# Altium project Performance_Fitness_Vest.PrjPcb (part 1 of 2)
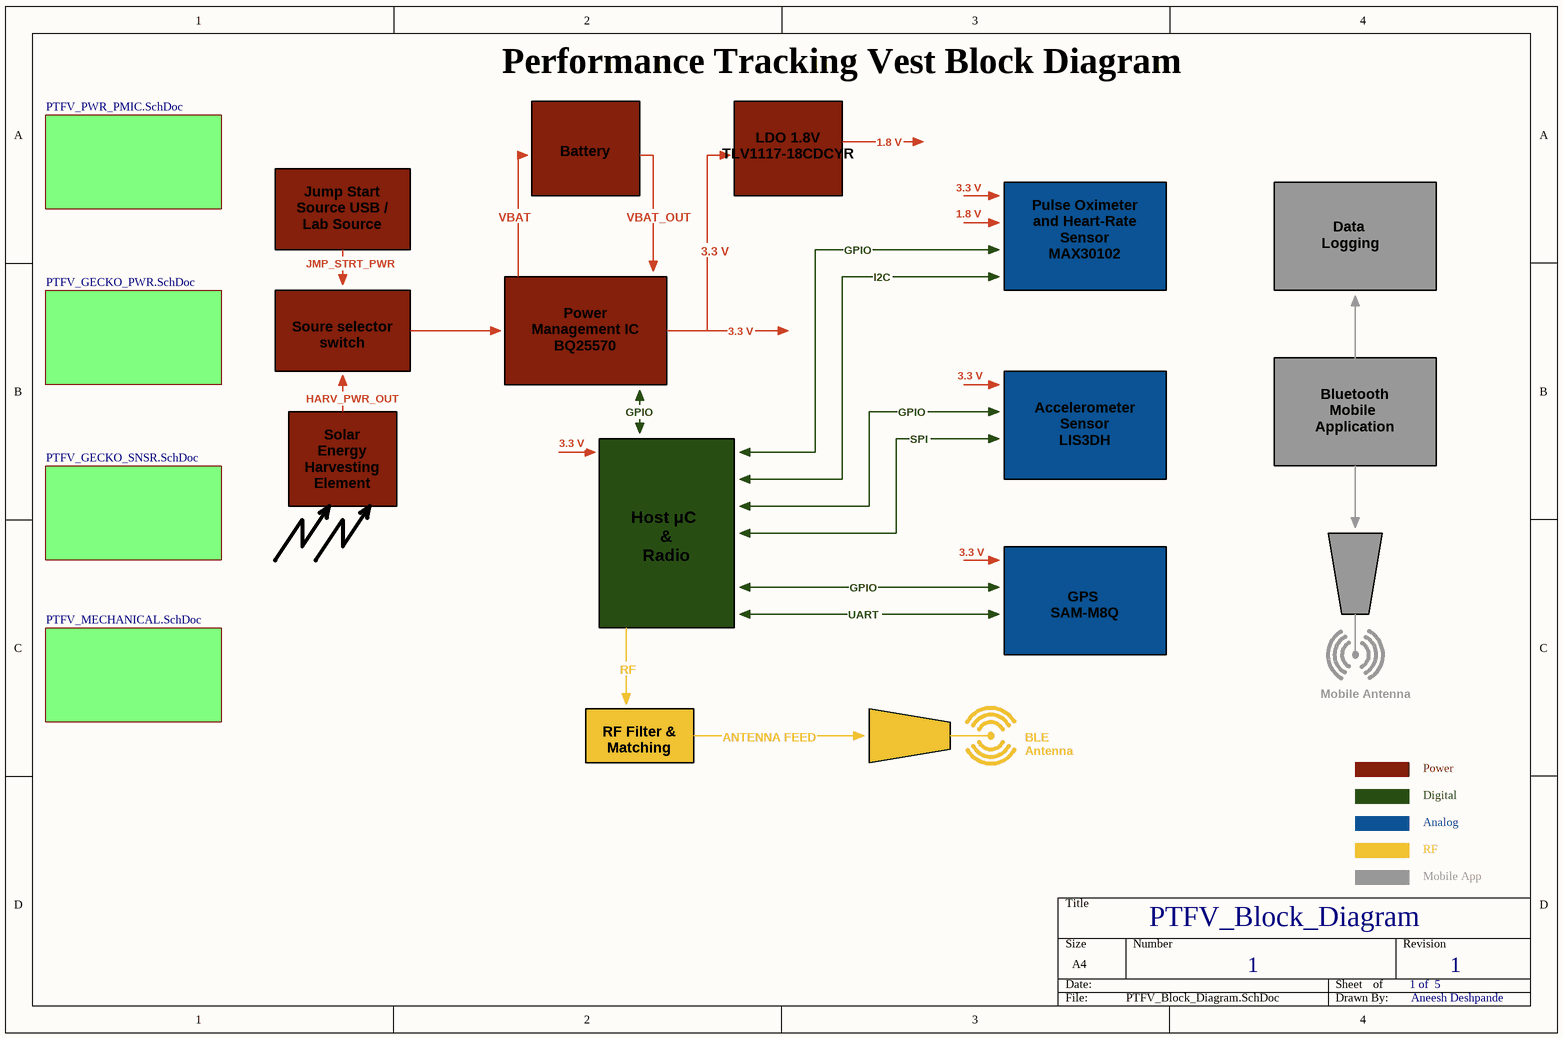
[diagram p0: PTFV_Block_Diagram.SchDoc]
5 sheets, 65 parts. Net scope: flat (ports and power ports of the same name join across sheets).
Sheets:
  PTFV_Block_Diagram.SchDoc
    Designator = PTFV_PWR_PMIC.SchDoc
    Designator = PTFV_GECKO_PWR.SchDoc
    Designator = PTFV_GECKO_SNSR.SchDoc
    Designator = PTFV_MECHANICAL.SchDoc

## Sheet PTFV_Block_Diagram.SchDoc: PTFV_Block_Diagram
size A4; DrawnBy: Aneesh Deshpande; DocumentNumber: 1; Revision: 1; SheetNumber: 1; SheetTotal: 1 of  5

### Sub-sheets
Designator = PTFV_PWR_PMIC.SchDoc: no entries
Designator = PTFV_GECKO_PWR.SchDoc: no entries
Designator = PTFV_GECKO_SNSR.SchDoc: no entries
Designator = PTFV_MECHANICAL.SchDoc: no entries

### Notes on the sheet
- Performance Tracking Vest Block Diagram
- Battery
- LDO 1.8V  TLV1117-18CDCYR
- 1.8 V
- Jump Start Source USB / Lab Source
- VBAT
- VBAT_OUT
- 3.3 V
- GPIO
- JMP_STRT_PWR
- I2C
- Pulse Oximeter and Heart-Rate Sensor
  MAX30102
- Data
  Logging
- Soure selector switch
- Power Management IC BQ25570
- HARV_PWR_OUT
- SPI
- Accelerometer
  Sensor
  LIS3DH
- Bluetooth
  Mobile
  Application
- Solar Energy Harvesting Element
- Host μC
  &
  Radio
- UART
- GPS
  SAM-M8Q
- RF
- Mobile Antenna
- RF Filter &
  Matching
- ANTENNA FEED
- BLE
  Antenna
- Power
- Digital
- Analog
- Mobile App

## Sheet PTFV_PWR_PMIC.SchDoc: PTFV_PWR_PMIC
size A4; DrawnBy: Aneesh Deshpande; Revision: 1; SheetNumber: 2; SheetTotal: 2  of  5
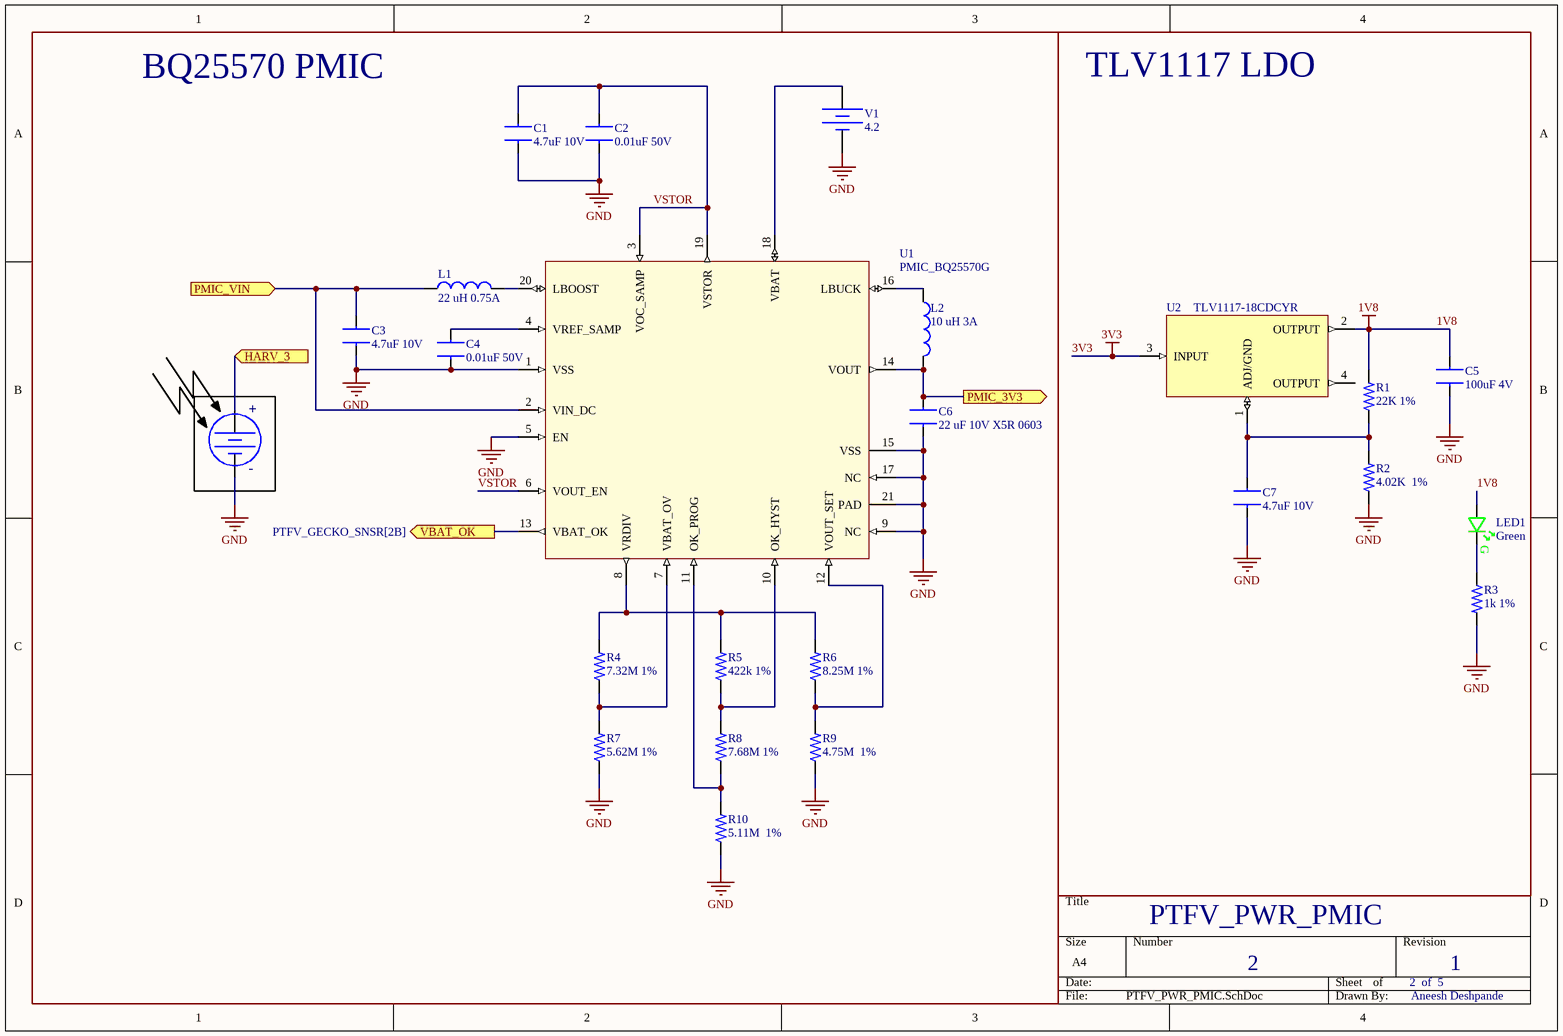
[diagram p1: PTFV_PWR_PMIC.SchDoc]

### Parts
C1  4.7uF 10V  [CAP_0603_1MM]
C2  0.01uF 50V  [CAP_0603_1MM]
C3  4.7uF 10V  [CAP_0603_1MM]
C4  0.01uF 50V  [CAP_0603_1MM]
C5  100uF 4V  [CAP_0603_1MM]
C6  22 uF 10V X5R 0603  [CAP_0603_1MM]
C7  4.7uF 10V  [CAP_0603_1MM]
L1  22 uH 0.75A  [IND_2828x30]
L2  10 uH 3A  [IND_100X30]
LED1  Green  [LED_0603_GRN_WL-SMCW]
R1  22K 1%  [RES_0603_1608X06]
R2  4.02K  1%  [RES_0603_1608X06]
R3  1k 1%  [RES_0603_1608X06]
R4  7.32M 1%  [RES_0603_1608X06]
R5  422k 1%  [RES_0603_1608X06]
R6  8.25M 1%  [RES_0603_1608X06]
R7  5.62M 1%  [RES_0603_1608X06]
R8  7.68M 1%  [RES_0603_1608X06]
R9  4.75M  1%  [RES_0603_1608X06]
R10  5.11M  1%  [RES_0603_1608X06]
U1  PMIC_BQ25570G  [20_QFN_PMIC]
U2  TLV1117-18CDCYR  [SOT23_4_LDO]
V1  DC Magnitude: 4.2  (hidden comment: Constant Voltage Source)
V2  Constant Voltage Source  (value not drawn)

### Blocks framed on the sheet
BQ25570 PMIC: C1-C4 C6 L1 L2 R4-R10 U1 V1 V2
TLV1117 LDO: C5 C7 LED1 R1-R3 U2

### Ports
HARV_3 (in, see PTFV_MECHANICAL[1B]), PMIC_3V3 (out, see PTFV_MECHANICAL[1C]), PMIC_VIN (in, see PTFV_MECHANICAL[1B]), VBAT_OK (out, see PTFV_GECKO_SNSR[2B])

### Nets
1V8: C5.1 LED1.A R1.2 U2.2(OUTPUT)
3V3: U2.3(INPUT)
GND: C1.2 C2.2 C3.2 C4.2 C5.2 C6.2 C7.2 R2.1 R3.2 R7.1 R9.1 R10.1 U1.1(VSS) U1.5(EN) U1.9(NC) U1.15(VSS) U1.17(NC) U1.21(PAD) V1.2 V2.2
VSTOR: C1.1 C2.1 U1.3(VOC_SAMP) U1.6(VOUT_EN) U1.19(VSTOR)
NetC3_1: C3.1 L1.1 U1.2(VIN_DC) ; port PMIC_VIN
NetC4_1: C4.1 U1.4(VREF_SAMP)
NetC6_1: C6.1 L2.2 U1.14(VOUT) ; port PMIC_3V3
NetC7_1: C7.1 R1.1 R2.2 U2.1(ADJ/GND)
NetH2_3: V2.1 ; port HARV_3
NetL1_2: L1.2 U1.20(LBOOST)
NetL2_1: L2.1 U1.16(LBUCK)
NetLED1_C: LED1.C R3.1
NetR4_1: R4.1 R7.2 U1.7(VBAT_OV)
NetR4_2: R4.2 R5.2 R6.2 U1.8(VRDIV)
NetR5_1: R5.1 R8.2 U1.10(OK_HYST)
NetR6_1: R6.1 R9.2 U1.12(VOUT_SET)
NetR8_1: R8.1 R10.2 U1.11(OK_PROG)
NetU1_13: U1.13(VBAT_OK) ; port VBAT_OK
NetU1_18: U1.18(VBAT) V1.1

Not connected (* = marked no-connect by the designer): U2 4(OUTPUT)

### Notes on the sheet
- (near V2) +
- (near V2) -
- (in symbol 150060GS75000) G

### Library data of the parts
C1 C3 C7 = CL10A475KP8NNNC: CAP CER 4.7UF 10V X5R 0603; Manufacturer: Samsung; Material: 4241ConductorMaterial; Tolerance: 10%; Supplier: Digi-Key; Supplier Part Number: 1276-1044-1-ND; Manufacturer Part Number: CL10A475KP8NNNC; RoHS: Yes; Category: Ceramic Capacitors; Stock: 4678169; Pricing: 1=0.1, 10=0.043, 50=0.0234, 100=0.0192, 500=0.01368, 1000=0.01075 (USD); Mounting Technology: Surface Mount; Case/Package: 0603; Case Code (Metric): 1608; Case Code (Imperial): 0603; Min Operating Temperature: -55°C; Max Operating Temperature: 85°C; Package Quantity: 1; Packaging: Tape and Reel; Value: 4.7uF; Voltage Rating: 10V; Dielectric: X5R; Series: CL; Construction: Flat; Voltage Rating (DC): 10V; Length: 1.6mm; Width: 0.031inch; Height: 0.8mm; Thickness: 0.035inch; Depth: 0.8mm; Radiation Hardening: No; RoHS Compliant: Yes; ComponentLink1URL: https://datasheet.ciiva.com/25797/cl10a475kp8nnnc-25797520.pdf?src-supplier=Digi-Key; ComponentLink1Description: https://datasheet.ciiva.com/25797/cl10a475kp8nnnc-25797520.pdf?src-supplier=Digi-Key; ComponentLink2URL: https://datasheet.ciiva.com/26838/getdatasheetpartid-358676-26838384.pdf?src-supplier=Verical; ComponentLink2Description: https://datasheet.ciiva.com/26838/getdatasheetpartid-358676-26838384.pdf?src-supplier=Verical; ComponentLink3URL: https://datasheet.ciiva.com/16318/cl05b104kq5nnnc-16318245.pdf?src-supplier=Future+Electronics; ComponentLink3Description: https://datasheet.ciiva.com/16318/cl05b104kq5nnnc-16318245.pdf?src-supplier=Future+Electronics
C2 C4 = CC0603KRX7R9BB103: CAP CER 0.01uF 50V X7R 0603; Manufacturer: Yageo; Dielectric Material: Ceramic; Value: 10nF; Multilayer: Yes; Tolerance  (fill in as +-): 10%; Supplier: Digi-Key; Supplier Part Number: 311-1085-1-ND; Manufacturer Part Number: CC0603KRX7R9BB103; RoHS: Yes; Category: Ceramic Capacitors; Stock: 5912727; Pricing: 1=0.1, 10=0.032, 50=0.0176, 100=0.0144, 500=0.01026, 1000=0.00805 (USD); Mounting Technology: Surface Mount; Pins: 2; Package Shape: Rectangular; Case/Package: 0603; Terminal Finish: Nickel; Min Operating Temperature: -55°C; Max Operating Temperature: 125°C; JESD-609 Code: e3; Capacitor Type: Ceramic; Package Style: SMTMeter; Packaging: Tape and Reel; Tolerance (fill in as +-): 10%; Rated DC Voltage (URdc): 50V; Temperature Characteristics Code: X7R; Termination: Wraparound; Length: 1.6mm; Width: 0.8mm; Height: 0.8mm; Reach SVHC Compliant: Yes; RoHS Compliant: Yes; ComponentLink1URL: https://datasheet.ciiva.com:443/pdfs/VipMasterIC/IC/YAGO/YAGO-S-A0003557223/YAGO-S-A0003557223-1.pdf?src-supplier=IHS+Markit; ComponentLink1Description: https://datasheet.ciiva.com:443/pdfs/VipMasterIC/IC/YAGO/YAGO-S-A0003557223/YAGO-S-A0003557223-1.pdf?src-supplier=IHS+Markit; ComponentLink2URL: https://datasheet.ciiva.com/28450/1489800-28450619.pdf?src-supplier=Element14; ComponentLink2Description: https://datasheet.ciiva.com/28450/1489800-28450619.pdf?src-supplier=Element14; ComponentLink3URL: https://datasheet.ciiva.com/176/mlccorderingcode-176551.pdf?src-supplier=Digi-Key; ComponentLink3Description: https://datasheet.ciiva.com/176/mlccorderingcode-176551.pdf?src-supplier=Digi-Key; ComponentLink4URL: https://datasheet.ciiva.com/176/mlccorderingcode-176550.pdf?src-supplier=Digi-Key; ComponentLink4Description: https://datasheet.ciiva.com/176/mlccorderingcode-176550.pdf?src-supplier=Digi-Key; ComponentLink5URL: https://datasheet.ciiva.com/13389/upy-gphc-x7r-6-3v-to-50v-8-13389991.pdf?src-supplier=Mouser; ComponentLink5Description: https://datasheet.ciiva.com/13389/upy-gphc-x7r-6-3v-to-50v-8-13389991.pdf?src-supplier=Mouser
C5 = 298W107X0004M2T: CAP TANT 100uF / 4V 0603; Manufacturer: Vishay Sprague; Manufacturer Series: 298W; Dielectric Material: Tantalum; Polarity: Polarized; ESR (Equivalent Series Resistance): 15R; Leakage Current: 110uA; Tolerance  (fill in as +-): 20%; Ripple Current: 41mA; Tan Delta: 0.6; Supplier: Digi-Key; Supplier Part Number: 718-2216-1-ND; Manufacturer Part Number: 298W107X0004M2T; RoHS: Yes; Category: Tantalum Capacitors; Stock: 3192; Pricing: 1=1.61, 10=1.273, 50=1.103, 100=0.9544, 500=0.72114, 1000=0.6363 (USD); Mounting Technology: Surface Mount; Pins: 2; Package Shape: Rectangular; Case/Package: 0603; Terminal Finish: Tin; Min Operating Temperature: -55°C; Max Operating Temperature: 125°C; JESD-609 Code: e3; Value: 100uF; Capacitor Type: Tantalum; Package Style: SMTMeter; Packaging: Tape and Reel; Tolerance (fill in as +-): 20%; Rated DC Voltage (URdc): 4V; Series: 298W; Termination: Wraparound; Length: 1.6mm; Width: 0.85mm; Height: 0.9mm; Reach SVHC Compliant: Yes; RoHS Compliant: Yes; ComponentLink1URL: https://datasheet.ciiva.com:443/pdfs/VipMasterIC/IC/VISH/VISH-S-A0008609316/VISH-S-A0008609316-1.pdf?src-supplier=IHS+Markit; ComponentLink1Description: https://datasheet.ciiva.com:443/pdfs/VipMasterIC/IC/VISH/VISH-S-A0008609316/VISH-S-A0008609316-1.pdf?src-supplier=IHS+Markit; ComponentLink2URL: http://www.vishay.com/docs/40169/typperfchar298dwtrl8.pdf?src-supplier=Digi-Key; ComponentLink2Description: http://www.vishay.com/docs/40169/typperfchar298dwtrl8.pdf?src-supplier=Digi-Key; ComponentLink3URL: http://www.vishay.com/docs/40065/298d298w.pdf?src-supplier=Digi-Key; ComponentLink3Description: http://www.vishay.com/docs/40065/298d298w.pdf?src-supplier=Digi-Key
C6 = GRM188R61A226ME15D: CAP CER 22UF 10V X5R 0603; Manufacturer: Murata; Voltage Rating DC: 10 VDC; Tolerance: 20 %; Brand: Murata Electronics; Type: Voltage and Temperature Derating Recommended Product; Unit Weight: 0.000222 oz; Supplier 1: Digi-Key; Supplier Part Number 1: 490-10476-1-ND; Manufacturer Part Number: GRM188R61A226ME15D; Stock 1: 849458; Pricing 1: 1=0.33, 10=0.226, 50=0.1506, 100=0.1279, 500=0.0903, 1000=0.079 (USD); Product Category: Multilayer Ceramic Capacitors MLCC - SMD/SMT; RoHS: True; Capacitance: 22uF; Dielectric: X5R; Case Code - in: 0603; Case Code - mm: 1608; Height: 0.8 mm; Maximum Operating Temperature: + 85 C; Minimum Operating Temperature: - 55 C; Product: General Type MLCCs; Series: GRM; Packaging: Reel; Length: 1.6 mm; Package / Case: 0603 (1608 metric); Factory Pack Quantity: 4000; Termination Style: SMD/SMT; Width: 0.8 mm; ComponentLink1URL: http://www.farnell.com/datasheets/2047978.pdf?src-supplier=Element14; ComponentLink1Description: http://www.farnell.com/datasheets/2047978.pdf?src-supplier=Element14
L1 = 744025220: IND FER 22uH 20% SMD; Manufacturer: Wurth Electronics; Core Material: Ferrite; DC Resistance (DCR): 575mR; Inductor Application: RF INDUCTOR; Inductor Type: GENERAL PURPOSE INDUCTOR; Channels: 1; Max Current Rating: 500mA; Self Resonant Frequency: 23MHz; Shape/Size Description: RECTANGULAR PACKAGE; Shielding: Unshielded; Test Frequency: 100kHz; Case/Size Code: 1111; Package Length: 2.8mm; Supplier: Digi-Key; Supplier Part Number: 732-2619-1-ND; Manufacturer Part Number: 744025220; RoHS: Yes; Category: Fixed Inductors; Stock: 10497; Pricing: 1=1.64, 10=1.578, 50=1.45, 100=1.205, 250=1.088 (USD); Pins: 2; Terminal Finish: Copper; Min Operating Temperature: -40°C; Max Operating Temperature: 125°C; Tolerance: 20%; Construction: Chip; Inductance-Nom (L): 22uH; Package Style: SMTMeter; Packaging: Tape and Reel; Surface Mount: Yes; Terminal Placement: Dual Ended; Termination: Wraparound; JESD-609 Code: e2; Package Height: 2.8mm; Package Width: 2.8mm; Reach SVHC Compliant: Yes; RoHS Compliant: Yes; ComponentLink1URL: https://datasheet.ciiva.com:443/pdfs/VipMasterIC/IC/MIDC/MIDC-S-A0002801275/MIDC-S-A0002801275-1.pdf?src-supplier=IHS+Markit; ComponentLink1Description: https://datasheet.ciiva.com:443/pdfs/VipMasterIC/IC/MIDC/MIDC-S-A0002801275/MIDC-S-A0002801275-1.pdf?src-supplier=IHS+Markit; ComponentLink2URL: https://datasheet.ciiva.com/6697/744025220-6697526.pdf?src-supplier=Digi-Key; ComponentLink2Description: https://datasheet.ciiva.com/6697/744025220-6697526.pdf?src-supplier=Digi-Key; ComponentLink3URL: https://datasheet.ciiva.com/4954/744025220-66606-4954805.pdf?src-supplier=Mouser; ComponentLink3Description: https://datasheet.ciiva.com/4954/744025220-66606-4954805.pdf?src-supplier=Mouser; ComponentLink4URL: https://datasheet.ciiva.com/11803/0900766b80f886ba-11803595.pdf?src-supplier=Rs; ComponentLink4Description: https://datasheet.ciiva.com/11803/0900766b80f886ba-11803595.pdf?src-supplier=Rs; ComponentLink5URL: https://datasheet.ciiva.com/6697/744025220-6697527.pdf?src-supplier=Digi-Key; ComponentLink5Description: https://datasheet.ciiva.com/6697/744025220-6697527.pdf?src-supplier=Digi-Key; ComponentLink6URL: https://datasheet.ciiva.com/48691/001087107-da-01-ml-we-tpc-smd-speicherdrossel-7440252-de-en-48691031.pdf?src-supplier=Conrad; ComponentLink6Description: https://datasheet.ciiva.com/48691/001087107-da-01-ml-we-tpc-smd-speicherdrossel-7440252-de-en-48691031.pdf?src-supplier=Conrad
L2 = 744065100: IND FER 10uH 20% SMD; Manufacturer: Wurth Electronics; Core Material: Ferrite; Tolerance: 30%; Case/Size Code: 3939; DC Resistance (DCR): 53mR; Inductor Application: POWER INDUCTOR; Inductor Type: GENERAL PURPOSE INDUCTOR; Channels: 1; Shape/Size Description: RECTANGULAR PACKAGE; Shielding: Unshielded; Test Frequency: 100kHz; Self Resonant Frequency: 25MHz; Package Height: 2.8mm; Package Length: 10mm; Supplier: Digi-Key; Supplier Part Number: 732-1060-1-ND; Manufacturer Part Number: 744065100; RoHS: Yes; Category: Fixed Inductors; Stock: 6976; Pricing: 1=1.87, 10=1.815, 50=1.588, 100=1.452, 500=1.362 (USD); Pins: 2; Terminal Finish: Copper; Min Operating Temperature: -40°C; Max Operating Temperature: 115°C; Inductance-Nom (L): 10uH; Surface Mount: Yes; Terminal Placement: Dual Ended; Termination: One Surface; Construction: Chip; Package Style: SMTMeter; Packaging: Tape and Reel; Max Current Rating: 3A; JESD-609 Code: e1; Package Width: 10mm; Reach SVHC Compliant: Yes; RoHS Compliant: Yes; ComponentLink1URL: https://datasheet.ciiva.com:443/pdfs/VipMasterIC/IC/MIDC/MIDC-S-A0004023785/MIDC-S-A0004023813-1.pdf?src-supplier=IHS+Markit; ComponentLink1Description: https://datasheet.ciiva.com:443/pdfs/VipMasterIC/IC/MIDC/MIDC-S-A0004023785/MIDC-S-A0004023813-1.pdf?src-supplier=IHS+Markit; ComponentLink2URL: https://datasheet.ciiva.com/6700/744065100-6700129.pdf?src-supplier=Digi-Key; ComponentLink2Description: https://datasheet.ciiva.com/6700/744065100-6700129.pdf?src-supplier=Digi-Key; ComponentLink3URL: https://datasheet.ciiva.com/7892/1735582-7892636.pdf?src-supplier=Element14; ComponentLink3Description: https://datasheet.ciiva.com/7892/1735582-7892636.pdf?src-supplier=Element14; ComponentLink4URL: https://datasheet.ciiva.com/13279/744065100-77259-13279329.pdf?src-supplier=Mouser; ComponentLink4Description: https://datasheet.ciiva.com/13279/744065100-77259-13279329.pdf?src-supplier=Mouser; ComponentLink5URL: https://datasheet.ciiva.com/11800/0900766b80d87d9b-11800272.pdf?src-supplier=Rs; ComponentLink5Description: https://datasheet.ciiva.com/11800/0900766b80d87d9b-11800272.pdf?src-supplier=Rs; ComponentLink6URL: https://datasheet.ciiva.com/6700/744065100-6700125.pdf?src-supplier=Digi-Key; ComponentLink6Description: https://datasheet.ciiva.com/6700/744065100-6700125.pdf?src-supplier=Digi-Key; ComponentLink7URL: https://datasheet.ciiva.com/6700/744065100-6700127.pdf?src-supplier=Digi-Key; ComponentLink7Description: https://datasheet.ciiva.com/6700/744065100-6700127.pdf?src-supplier=Digi-Key
LED1 = 150060GS75000: LED, 0603, GREEN, 430MCD, 520NM; Manufacturer: Wurth Electronics; Dynamic Catalog: 0603 Rectangle with Flat Top Chip LEDs; 3D Model: SMCW_0603.igs / SMCW_0603.stp / SMCW_0603.wrl; Wavelength - Peak: 515nm; Voltage - Forward (Vf) (Typ): 3.2V; Current - Test: 20mA; Viewing Angle: 140°; Lens Type: Clear; Lens Style/Size: Rectangle with Flat Top, 1.1mm x 0.7mm; Other Names: 732-4971-2; Supplier 1: Digi-Key; Manufacturer Part Number: 150060GS75000; Stock 1: 34964; Pricing 1: 1=0.14, 50=0.129, 100=0.11, 500=0.095 (USD); Standard Package: 4,000; Category: Optoelectronics; Family: LED Indication - Discrete; Series: WL-SMCW; Packaging: Tape & Reel (TR); Color: Green; Wavelength - Dominant: 520nm; Millicandela Rating: 430mcd; Package / Case: 0603 (1608 Metric); Size / Dimension: 1.60mm L x 0.80mm W; Height: 0.70mm; Mounting Type: Surface Mount; Online Catalog: 0603 Rectangle with Flat Top Chip LEDs; ComponentLink1URL: https://katalog.we-online.de/led/datasheet/150060GS75000.pdf?src-supplier=Digi-Key; ComponentLink1Description: https://katalog.we-online.de/led/datasheet/150060GS75000.pdf?src-supplier=Digi-Key; ComponentLink2URL: http://www.produktinfo.conrad.com/datenblaetter/750000-774999/759427-da-01-en-CHIPLED_0603_W_KL_GRUEN_150060GS75000.pdf?src-supplier=Conrad; ComponentLink2Description: http://www.produktinfo.conrad.com/datenblaetter/750000-774999/759427-da-01-en-CHIPLED_0603_W_KL_GRUEN_150060GS75000.pdf?src-supplier=Conrad; Supplier Part Number 1: 732-4971-1-ND
R1 = RC0603JR-0722KL: RES SMD 22K OHM 1% 1/10W 0603; Manufacturer: Yageo; Tolerance: 5%; Additional Feature: LASER TRIMMABLE; Power: 100mW; Rated Temperature: 70°C; Value: 22kR; Temperature Coefficient: 100ppm/°C; Working Voltage: 75V; Package Height: 0.45mm; Package Length: 1.6mm; Package Width: 0.8mm; Supplier: Digi-Key; Supplier Part Number: 311-22KGRCT-ND; Manufacturer Part Number: RC0603JR-0722KL; RoHS: Yes; Category: Chip SMD Resistors; Stock: 1677716; Pricing: 1=0.1, 10=0.015, 50=0.0094, 100=0.0077, 500=0.00518, 1000=0.00443 (USD); Mounting Technology: Surface Mount; Pins: 2; Package Shape: Rectangular; Case/Package: 0603; Terminal Finish: Nickel; Min Operating Temperature: -55°C; Max Operating Temperature: 155°C; JESD-609 Code: e3; Resistor Type: FIXED RESISTOR; Construction: Chip; Package Style: SMTMeter; Packaging: Tape and Reel; Technology: METAL GLAZE/THICK FILM; Termination: Wraparound; Reach SVHC Compliant: Yes; RoHS Compliant: Yes; ComponentLink1URL: https://datasheet.ciiva.com:443/pdfs/VipMasterIC/IC/YAGO/YAGO-S-A0008145938/YAGO-S-A0008145938-1.pdf?src-supplier=IHS+Markit; ComponentLink1Description: https://datasheet.ciiva.com:443/pdfs/VipMasterIC/IC/YAGO/YAGO-S-A0008145938/YAGO-S-A0008145938-1.pdf?src-supplier=IHS+Markit; ComponentLink2URL: https://datasheet.ciiva.com/7746/443971-7746469.pdf?src-supplier=Element14; ComponentLink2Description: https://datasheet.ciiva.com/7746/443971-7746469.pdf?src-supplier=Element14; ComponentLink3URL: https://datasheet.ciiva.com/7746/443971-7746470.pdf?src-supplier=Element14; ComponentLink3Description: https://datasheet.ciiva.com/7746/443971-7746470.pdf?src-supplier=Element14; ComponentLink4URL: https://datasheet.ciiva.com/15189/getdatasheetpartid-325210-15189861.pdf?src-supplier=Verical; ComponentLink4Description: https://datasheet.ciiva.com/15189/getdatasheetpartid-325210-15189861.pdf?src-supplier=Verical
R2 = RC0603FR-074K02L: RES SMD 4.02K OHM 1% 1/10W 0603; Manufacturer: Yageo; Additional Feature: LASER TRIMMABLE; Power: 100mW; Rated Temperature: 70°C; Value: 4.02kR; Temperature Coefficient: 100ppm/°C; Working Voltage: 75V; Package Height: 0.45mm; Package Length: 1.6mm; Package Width: 0.8mm; Supplier: Digi-Key; Supplier Part Number: 311-4.02KHRCT-ND; Manufacturer Part Number: RC0603FR-074K02L; RoHS: Yes; Category: Chip SMD Resistors; Stock: 1172107; Pricing: 1=0.1, 10=0.018, 50=0.0106, 100=0.0088, 500=0.00592, 1000=0.00505 (USD); Mounting Technology: Surface Mount; Pins: 2; Package Shape: Rectangular; Case/Package: 0603; Terminal Finish: Nickel; Min Operating Temperature: -55°C; Max Operating Temperature: 155°C; Tolerance: 1%; JESD-609 Code: e3; Resistor Type: FIXED RESISTOR; Construction: Chip; Package Style: SMTMeter; Packaging: Tape and Reel; Technology: METAL GLAZE/THICK FILM; Termination: Wraparound; Reach SVHC Compliant: Yes; RoHS Compliant: Yes; ComponentLink1URL: https://datasheet.ciiva.com:443/pdfs/VipMasterIC/IC/YAGO/YAGO-S-A0008145938/YAGO-S-A0008145938-1.pdf?src-supplier=IHS+Markit; ComponentLink1Description: https://datasheet.ciiva.com:443/pdfs/VipMasterIC/IC/YAGO/YAGO-S-A0008145938/YAGO-S-A0008145938-1.pdf?src-supplier=IHS+Markit; ComponentLink2URL: https://datasheet.ciiva.com/15189/getdatasheetpartid-323806-15189751.pdf?src-supplier=Verical; ComponentLink2Description: https://datasheet.ciiva.com/15189/getdatasheetpartid-323806-15189751.pdf?src-supplier=Verical; ComponentLink3URL: https://datasheet.ciiva.com/2454/pyu-r-int-thick-7-2454036.pdf?src-supplier=Digi-Key; ComponentLink3Description: https://datasheet.ciiva.com/2454/pyu-r-int-thick-7-2454036.pdf?src-supplier=Digi-Key
R3 = RC0603FR-071KL: RES SMD 1k OHM 1% 1/10W 0603; Manufacturer: Yageo; Power Rating: 100mW; Value: 1kR; Voltage Rating: 50V; Temperature Coefficient: 100ppm/°C; Supplier: Digi-Key; Supplier Part Number: 311-1.00KHRCT-ND; Manufacturer Part Number: RC0603FR-071KL; RoHS: Yes; Category: Chip SMD Resistors; Stock: 18911788; Pricing: 1=0.1, 10=0.018, 50=0.0106, 100=0.0088, 500=0.00592, 1000=0.00505 (USD); Case/Package: 0603; Case Code (Imperial): 0603; Case Code (Metric): 1608; Contact Plating: Tin,Matte; Min Operating Temperature: -55°C; Max Operating Temperature: 155°C; Tolerance: 1%; Packaging: Tape and Reel; Termination: SMD/SMT; Resistor Type: Thick Film; Features: Moisture Resistant; Series: RC; Max Power Dissipation: 100mW; Number of Terminations: 2; Resistance Tolerance: 1%; Construction: Rectangular; Technology: THICK FILM; Length: 1.6mm; Height: 0.45mm; Depth: 0.8mm; Reach SVHC Compliant: No; Military Standard: Not; RoHS Compliant: Yes; Lead Free: 5697LeadFree
R4 = CRCW06037M32FKEA: RES SMD 7.32M OHM 1% 1/10W 0603; Manufacturer: Vishay; Power: 100mW; Rated Temperature: 70°C; Value: 7.32MR; Temperature Coefficient: 100ppm/°C; Working Voltage: 75V; Package Height: 0.45mm; Package Length: 1.55mm; Package Width: 0.85mm; Reference Standard: AEC-Q200; Supplier: Digi-Key; Supplier Part Number: 541-7.32MHCT-ND; Manufacturer Part Number: CRCW06037M32FKEA; RoHS: Yes; Category: Chip SMD Resistors; Stock: 19800; Pricing: 1=0.1, 10=0.026, 50=0.0164, 100=0.0137, 500=0.00936, 1000=0.00808 (USD); Mounting Technology: Surface Mount; Pins: 2; Package Shape: Rectangular; Case/Package: 0603; Terminal Finish: Nickel; Min Operating Temperature: -55°C; Max Operating Temperature: 155°C; Tolerance: 1%; JESD-609 Code: e3; Resistor Type: FIXED RESISTOR; Construction: Chip; Package Style: SMTMeter; Packaging: Tape and Reel; Technology: METAL GLAZE/THICK FILM; Termination: Wraparound; Reach SVHC Compliant: Yes; RoHS Compliant: Yes; ComponentLink1URL: https://datasheet.ciiva.com:443/pdfs/VipMasterIC/IC/VISH/VISH-S-A0007266705/VISH-S-A0007266705-1.pdf?src-supplier=IHS+Markit; ComponentLink1Description: https://datasheet.ciiva.com:443/pdfs/VipMasterIC/IC/VISH/VISH-S-A0007266705/VISH-S-A0007266705-1.pdf?src-supplier=IHS+Markit; ComponentLink2URL: https://datasheet.ciiva.com/5588/dcrcwe3-109170-5588998.pdf?src-supplier=Mouser; ComponentLink2Description: https://datasheet.ciiva.com/5588/dcrcwe3-109170-5588998.pdf?src-supplier=Mouser; ComponentLink3URL: https://datasheet.ciiva.com/22676/1700796-22676479.pdf?src-supplier=Element14; ComponentLink3Description: https://datasheet.ciiva.com/22676/1700796-22676479.pdf?src-supplier=Element14; ComponentLink4URL: https://datasheet.ciiva.com/2525/dcrcwe3-2525464.pdf?src-supplier=Digi-Key; ComponentLink4Description: https://datasheet.ciiva.com/2525/dcrcwe3-2525464.pdf?src-supplier=Digi-Key; ComponentLink5URL: https://datasheet.ciiva.com/2525/dcrcwe3-2525465.pdf?src-supplier=Digi-Key; ComponentLink5Description: https://datasheet.ciiva.com/2525/dcrcwe3-2525465.pdf?src-supplier=Digi-Key; ComponentLink6URL: https://datasheet.ciiva.com/2525/dcrcwe3-2525466.pdf?src-supplier=Digi-Key; ComponentLink6Description: https://datasheet.ciiva.com/2525/dcrcwe3-2525466.pdf?src-supplier=Digi-Key
R5 = RC0603FR-07422KL: RES SMD 422k OHM 1% 1/10W 0603; Manufacturer: Yageo; Additional Feature: LASER TRIMMABLE; Power: 100mW; Rated Temperature: 70°C; Value: 422kR; Temperature Coefficient: 100ppm/°C; Working Voltage: 75V; Package Height: 0.45mm; Package Length: 1.6mm; Package Width: 0.8mm; Supplier: Digi-Key; Supplier Part Number: 311-422KHRCT-ND; Manufacturer Part Number: RC0603FR-07422KL; RoHS: Yes; Category: Chip SMD Resistors; Stock: 92625; Pricing: 1=0.1, 10=0.018, 50=0.0106, 100=0.0088, 500=0.00592, 1000=0.00505 (USD); Mounting Technology: Surface Mount; Pins: 2; Package Shape: Rectangular; Case/Package: 0603; Terminal Finish: Nickel; Min Operating Temperature: -55°C; Max Operating Temperature: 155°C; Tolerance: 1%; JESD-609 Code: e3; Resistor Type: FIXED RESISTOR; Construction: Chip; Package Style: SMTMeter; Packaging: Tape and Reel; Technology: METAL GLAZE/THICK FILM; Termination: Wraparound; Reach SVHC Compliant: Yes; RoHS Compliant: Yes; ComponentLink1URL: https://datasheet.ciiva.com:443/pdfs/VipMasterIC/IC/YAGO/YAGO-S-A0008145938/YAGO-S-A0008145938-1.pdf?src-supplier=IHS+Markit; ComponentLink1Description: https://datasheet.ciiva.com:443/pdfs/VipMasterIC/IC/YAGO/YAGO-S-A0008145938/YAGO-S-A0008145938-1.pdf?src-supplier=IHS+Markit; ComponentLink2URL: https://datasheet.ciiva.com/2519/pyu-r-int-thick-7-2519172.pdf?src-supplier=Digi-Key; ComponentLink2Description: https://datasheet.ciiva.com/2519/pyu-r-int-thick-7-2519172.pdf?src-supplier=Digi-Key; ComponentLink3URL: https://datasheet.ciiva.com/2519/pyu-r-int-thick-7-2519173.pdf?src-supplier=Digi-Key; ComponentLink3Description: https://datasheet.ciiva.com/2519/pyu-r-int-thick-7-2519173.pdf?src-supplier=Digi-Key; ComponentLink4URL: https://datasheet.ciiva.com/2519/pyu-r-int-thick-7-2519171.pdf?src-supplier=Digi-Key; ComponentLink4Description: https://datasheet.ciiva.com/2519/pyu-r-int-thick-7-2519171.pdf?src-supplier=Digi-Key; ComponentLink5URL: https://datasheet.ciiva.com/8885/pyu-rc0603-51-rohs-l-4-8885786.pdf?src-supplier=Avnet; ComponentLink5Description: https://datasheet.ciiva.com/8885/pyu-rc0603-51-rohs-l-4-8885786.pdf?src-supplier=Avnet
R6 = CRCW06038M25FKEA: RES SMD 8.25M OHM 1% 1/10W 0603; Manufacturer: Vishay; Power: 100mW; Rated Temperature: 70°C; Value: 8.25MR; Temperature Coefficient: 100ppm/°C; Working Voltage: 75V; Package Height: 0.45mm; Package Length: 1.55mm; Package Width: 0.85mm; Reference Standard: AEC-Q200; Supplier: Digi-Key; Supplier Part Number: 541-8.25MHCT-ND; Manufacturer Part Number: CRCW06038M25FKEA; RoHS: Yes; Category: Chip SMD Resistors; Stock: 15731; Pricing: 1=0.1, 10=0.026, 50=0.0162, 100=0.0136, 500=0.00932, 1000=0.00805 (USD); Mounting Technology: Surface Mount; Pins: 2; Package Shape: Rectangular; Case/Package: 0603; Terminal Finish: Nickel; Min Operating Temperature: -55°C; Max Operating Temperature: 155°C; Tolerance: 1%; JESD-609 Code: e3; Resistor Type: FIXED RESISTOR; Construction: Chip; Package Style: SMTMeter; Packaging: Tape and Reel; Technology: METAL GLAZE/THICK FILM; Termination: Wraparound; Reach SVHC Compliant: Yes; RoHS Compliant: Yes; ComponentLink1URL: https://datasheet.ciiva.com:443/pdfs/VipMasterIC/IC/VISH/VISH-S-A0007266705/VISH-S-A0007266705-1.pdf?src-supplier=IHS+Markit; ComponentLink1Description: https://datasheet.ciiva.com:443/pdfs/VipMasterIC/IC/VISH/VISH-S-A0007266705/VISH-S-A0007266705-1.pdf?src-supplier=IHS+Markit; ComponentLink2URL: https://datasheet.ciiva.com/7748/1697337-7748717.pdf?src-supplier=Element14; ComponentLink2Description: https://datasheet.ciiva.com/7748/1697337-7748717.pdf?src-supplier=Element14; ComponentLink3URL: https://datasheet.ciiva.com/7748/1697337-7748718.pdf?src-supplier=Element14; ComponentLink3Description: https://datasheet.ciiva.com/7748/1697337-7748718.pdf?src-supplier=Element14; ComponentLink4URL: https://datasheet.ciiva.com/2513/dcrcwe3-2513731.pdf?src-supplier=Digi-Key; ComponentLink4Description: https://datasheet.ciiva.com/2513/dcrcwe3-2513731.pdf?src-supplier=Digi-Key; ComponentLink5URL: https://datasheet.ciiva.com/2513/dcrcwe3-2513732.pdf?src-supplier=Digi-Key; ComponentLink5Description: https://datasheet.ciiva.com/2513/dcrcwe3-2513732.pdf?src-supplier=Digi-Key; ComponentLink6URL: https://datasheet.ciiva.com/2513/dcrcwe3-2513733.pdf?src-supplier=Digi-Key; ComponentLink6Description: https://datasheet.ciiva.com/2513/dcrcwe3-2513733.pdf?src-supplier=Digi-Key
R7 = RMCF0603FT5M62: RES SMD 5.62M OHM 1% 1/10W 0603; Manufacturer: Stackpole Electronics; Power: 100mW; Rated Temperature: 70°C; Value: 5.62MR; Temperature Coefficient: 200ppm/°C; Working Voltage: 75V; Package Height: 0.45mm; Package Length: 1.55mm; Package Width: 0.8mm; Reference Standard: AEC-Q200; Supplier: Digi-Key; Supplier Part Number: RMCF0603FT5M62CT-ND; Manufacturer Part Number: RMCF0603FT5M62; RoHS: Yes; Category: Chip SMD Resistors; Stock: 11285; Pricing: 1=0.1, 10=0.02, 50=0.0124, 100=0.0103, 500=0.00688, 1000=0.00588 (USD); Mounting Technology: Surface Mount; Pins: 2; Package Shape: Rectangular; Case/Package: 0603; Terminal Finish: Nickel; Min Operating Temperature: -55°C; Max Operating Temperature: 155°C; Tolerance: 1%; JESD-609 Code: e3; Resistor Type: FIXED RESISTOR; Construction: Rectangular; Package Style: SMTMeter; Packaging: Tape and Reel; Technology: METAL GLAZE/THICK FILM; Termination: Wraparound; Reach SVHC Compliant: Yes; RoHS Compliant: Yes; ComponentLink1URL: https://datasheet.ciiva.com:443/pdfs/VipMasterIC/IC/SEIE/SEIE-S-A0009541969/SEIE-S-A0009541969-1.pdf?src-supplier=IHS+Markit; ComponentLink1Description: https://datasheet.ciiva.com:443/pdfs/VipMasterIC/IC/SEIE/SEIE-S-A0009541969/SEIE-S-A0009541969-1.pdf?src-supplier=IHS+Markit; ComponentLink2URL: https://www.seielect.com/catalog/SEI-RMCF_RMCP.pdf?src-supplier=Avnet; ComponentLink2Description: https://www.seielect.com/catalog/SEI-RMCF_RMCP.pdf?src-supplier=Avnet; ComponentLink3URL: https://www.seielect.com/catalog/sei-rmcf_rmcp.pdf?src-supplier=Digi-Key; ComponentLink3Description: https://www.seielect.com/catalog/sei-rmcf_rmcp.pdf?src-supplier=Digi-Key
R8 = RMCF0603FT7M68: RES SMD 7.68M OHM 1% 1/10W 0603; Manufacturer: Stackpole Electronics; Power: 100mW; Rated Temperature: 70°C; Value: 7.68MR; Temperature Coefficient: 200ppm/°C; Working Voltage: 75V; Package Height: 0.45mm; Package Length: 1.55mm; Package Width: 0.8mm; Reference Standard: AEC-Q200; Supplier: Digi-Key; Supplier Part Number: RMCF0603FT7M68CT-ND; Manufacturer Part Number: RMCF0603FT7M68; RoHS: Yes; Category: Chip SMD Resistors; Stock: 4881; Pricing: 1=0.1, 10=0.02, 50=0.0124, 100=0.0103, 500=0.00688, 1000=0.00588 (USD); Mounting Technology: Surface Mount; Pins: 2; Package Shape: Rectangular; Case/Package: 0603; Terminal Finish: Nickel; Min Operating Temperature: -55°C; Max Operating Temperature: 155°C; Tolerance: 1%; JESD-609 Code: e3; Resistor Type: FIXED RESISTOR; Construction: Rectangular; Package Style: SMTMeter; Packaging: Tape and Reel; Technology: METAL GLAZE/THICK FILM; Termination: Wraparound; Reach SVHC Compliant: Yes; RoHS Compliant: Yes; ComponentLink1URL: https://datasheet.ciiva.com:443/pdfs/VipMasterIC/IC/SEIE/SEIE-S-A0009541969/SEIE-S-A0009541969-1.pdf?src-supplier=IHS+Markit; ComponentLink1Description: https://datasheet.ciiva.com:443/pdfs/VipMasterIC/IC/SEIE/SEIE-S-A0009541969/SEIE-S-A0009541969-1.pdf?src-supplier=IHS+Markit; ComponentLink2URL: https://www.seielect.com/catalog/sei-rmcf_rmcp.pdf?src-supplier=Digi-Key; ComponentLink2Description: https://www.seielect.com/catalog/sei-rmcf_rmcp.pdf?src-supplier=Digi-Key; ComponentLink3URL: https://www.seielect.com/catalog/SEI-RMCF_RMCP.pdf?src-supplier=Avnet; ComponentLink3Description: https://www.seielect.com/catalog/SEI-RMCF_RMCP.pdf?src-supplier=Avnet
R9 = RC0603FR-074M75L: RES SMD 4.75M OHM 1% 1/10W 0603; Manufacturer: Yageo; Additional Feature: LASER TRIMMABLE; Power: 100mW; Rated Temperature: 70°C; Value: 4.75MR; Temperature Coefficient: 100ppm/°C; Working Voltage: 75V; Package Height: 0.45mm; Package Length: 1.6mm; Package Width: 0.8mm; Supplier: Digi-Key; Supplier Part Number: 311-4.75MHRCT-ND; Manufacturer Part Number: RC0603FR-074M75L; RoHS: Yes; Category: Chip SMD Resistors; Stock: 179670; Pricing: 1=0.1, 10=0.018, 50=0.0106, 100=0.0088, 500=0.00592, 1000=0.00505 (USD); Mounting Technology: Surface Mount; Pins: 2; Package Shape: Rectangular; Case/Package: 0603; Terminal Finish: Nickel; Min Operating Temperature: -55°C; Max Operating Temperature: 155°C; Tolerance: 1%; JESD-609 Code: e3; Resistor Type: FIXED RESISTOR; Construction: Chip; Package Style: SMTMeter; Packaging: Tape and Reel; Technology: METAL GLAZE/THICK FILM; Termination: Wraparound; Reach SVHC Compliant: Yes; RoHS Compliant: Yes; ComponentLink1URL: https://datasheet.ciiva.com:443/pdfs/VipMasterIC/IC/YAGO/YAGO-S-A0008145938/YAGO-S-A0008145938-1.pdf?src-supplier=IHS+Markit; ComponentLink1Description: https://datasheet.ciiva.com:443/pdfs/VipMasterIC/IC/YAGO/YAGO-S-A0008145938/YAGO-S-A0008145938-1.pdf?src-supplier=IHS+Markit; ComponentLink2URL: https://datasheet.ciiva.com/2455/pyu-r-int-thick-7-2455038.pdf?src-supplier=Digi-Key; ComponentLink2Description: https://datasheet.ciiva.com/2455/pyu-r-int-thick-7-2455038.pdf?src-supplier=Digi-Key; ComponentLink3URL: https://datasheet.ciiva.com/2455/pyu-r-int-thick-7-2455039.pdf?src-supplier=Digi-Key; ComponentLink3Description: https://datasheet.ciiva.com/2455/pyu-r-int-thick-7-2455039.pdf?src-supplier=Digi-Key; ComponentLink4URL: https://datasheet.ciiva.com/2455/pyu-r-int-thick-7-2455040.pdf?src-supplier=Digi-Key; ComponentLink4Description: https://datasheet.ciiva.com/2455/pyu-r-int-thick-7-2455040.pdf?src-supplier=Digi-Key
R10 = RC0603FR-075M11L: RES SMD 5.11M OHM 1% 1/10W 0603; Manufacturer: Yageo; Additional Feature: LASER TRIMMABLE; Power: 100mW; Rated Temperature: 70°C; Value: 5.11MR; Temperature Coefficient: 100ppm/°C; Working Voltage: 75V; Package Height: 0.45mm; Package Length: 1.6mm; Package Width: 0.8mm; Supplier: Digi-Key; Supplier Part Number: 13-RC0603FR-075M11LCT-ND; Manufacturer Part Number: RC0603FR-075M11L; RoHS: Yes; Category: Chip SMD Resistors; Stock: 33169; Pricing: 1=0.1, 10=0.018, 50=0.0106, 100=0.0088, 500=0.00592, 1000=0.00505 (USD); Mounting Technology: Surface Mount; Pins: 2; Package Shape: Rectangular; Case/Package: 0603; Terminal Finish: Nickel; Min Operating Temperature: -55°C; Max Operating Temperature: 155°C; Tolerance: 1%; JESD-609 Code: e3; Resistor Type: FIXED RESISTOR; Construction: Chip; Package Style: SMTMeter; Packaging: Tape and Reel; Technology: METAL GLAZE/THICK FILM; Termination: Wraparound; Reach SVHC Compliant: Yes; RoHS Compliant: Yes; ComponentLink1URL: https://datasheet.ciiva.com:443/pdfs/VipMasterIC/IC/YAGO/YAGO-S-A0008145938/YAGO-S-A0008145938-1.pdf?src-supplier=IHS+Markit; ComponentLink1Description: https://datasheet.ciiva.com:443/pdfs/VipMasterIC/IC/YAGO/YAGO-S-A0008145938/YAGO-S-A0008145938-1.pdf?src-supplier=IHS+Markit; ComponentLink2URL: http://www.mouser.com/catalog/specsheets/RC0603.pdf?src-supplier=Mouser; ComponentLink2Description: http://www.mouser.com/catalog/specsheets/RC0603.pdf?src-supplier=Mouser; ComponentLink3URL: http://www.yageo.com/documents/recent/PYu-RC_Group_51_RoHS_L_2.pdf?src-supplier=Avnet; ComponentLink3Description: http://www.yageo.com/documents/recent/PYu-RC_Group_51_RoHS_L_2.pdf?src-supplier=Avnet; ComponentLink4URL: http://www.yageo.com.tw/exep/pages/download/literatures/PYu-R_INT-thick_7.pdf?src-supplier=Digi-Key; ComponentLink4Description: http://www.yageo.com.tw/exep/pages/download/literatures/PYu-R_INT-thick_7.pdf?src-supplier=Digi-Key
U1 = BQ25570RGRR: IC ENERGY HARV CTRLR BATT 20VQFN; Manufacturer: Texas Instruments; Package Body Material: Plastic; Adjustable Threshold: Yes; Throw Configuration: POWER SUPPLY SUPPORT CIRCUIT; Number of Channels: 1; Max Supply Voltage: 5.1V; Min Supply Voltage: 100mV; Supplier: Digi-Key; Supplier Part Number: 296-39934-1-ND; Manufacturer Part Number: BQ25570RGRR; RoHS: Yes; Category: Battery Management; Stock: 13223; Pricing: 1=7.11, 10=6.421, 25=6.1224, 100=5.3161, 250=5.07716, 500=4.62918, 1000=4.03187 (USD); Case/Package: HVQCCN; Pins: 20; Package Shape: Square; Terminal Finish: Nickel; Min Operating Temperature: -40°C; Max Operating Temperature: 85°C; JESD-609 Code: e4; Moisture Sensitivity Level: 2; Channels: 1; Package Style: CHIP CARRIER, HEAT SINK/SLUG, VERY THIN PROFILEMeter; Peak Reflow Temperature (Cel): 260°C; Surface Mount: Yes; Terminal Form: No Lead; Terminal Position: QUAD; Length: 3.5mm; Width: 3.5mm; Height - Seated (Max): 1mm; Terminal Pitch: 0.5mm; Temperature Grade: INDUSTRIAL; Reach SVHC Compliant: Yes; RoHS Compliant: Yes; ComponentLink1URL: https://www.ti.com:443/lit/ds/symlink/bq25570.pdf?src-supplier=IHS+Markit; ComponentLink1Description: https://www.ti.com:443/lit/ds/symlink/bq25570.pdf?src-supplier=IHS+Markit; ComponentLink2URL: https://datasheet.ciiva.com/29590/bq25570-29590060.pdf?src-supplier=Digi-Key; ComponentLink2Description: https://datasheet.ciiva.com/29590/bq25570-29590060.pdf?src-supplier=Digi-Key
U2 = TLV1117-18CDCYR: LDO 1.8V; Manufacturer: Texas Instruments; Package Body Material: Plastic; Channels: 1; Adjustability: FIXED; Dropout Voltage1-Max: 1.3V; Dropout Voltage1-Nom: 1.2V; Input Voltage Absolute-Max: 16V; Max Supply Voltage: 15V; Min Input Voltage: 3.2V; Line Regulation-Max: 0.006%; Load Regulation-Max: 0.01%; Output Current1-Max: 800mA; Output Voltage1-Max: 1.854V; Output Voltage1-Min: 1.746V; Regulator Type: FIXED POSITIVE SINGLE OUTPUT LDO REGULATOR; Voltage Tolerance-Max: 3%; Qualification Status: Not Qualified; Supplier: Digi-Key; Supplier Part Number: 296-21108-1-ND; Manufacturer Part Number: TLV1117-18CDCYR; RoHS: Yes; Category: Voltage Regulators - Linear; Stock: 7191; Pricing: 1=0.8, 10=0.707, 25=0.6636, 100=0.5417, 250=0.5032, 500=0.42824, 1000=0.34259 (USD); Case/Package: SOP; Pins: 4; Package Shape: Rectangular; Terminal Finish: Tin; JESD-609 Code: e3; JESD-30 Code: R-PDSO-G4; Moisture Sensitivity Level: 2; Package Style: SMALL OUTLINEMeter; Peak Reflow Temperature (Cel): 260°C; Surface Mount: Yes; Terminal Form: Gull Wing; Terminal Position: DUAL; Number of Outputs: 1; Operating Temperature, TJ-Max: 125°C; Operating Temperature, TJ-Min: 0°C; Output Voltage1-Nom: 1.8V; Packaging: Tape and Reel; Technology: BIPOLAR; Length: 6.5mm; Width: 3.5mm; Height - Seated (Max): 1.8mm; Terminal Pitch: 2.3mm; Reach SVHC Compliant: Yes; RoHS Compliant: Yes; ComponentLink1URL: https://www.ti.com:443/lit/ds/symlink/tlv1117.pdf?src-supplier=IHS+Markit; ComponentLink1Description: https://www.ti.com:443/lit/ds/symlink/tlv1117.pdf?src-supplier=IHS+Markit; ComponentLink2URL: https://datasheet.ciiva.com/15111/getdatasheetpartid-48347-15111093.pdf?src-supplier=Verical; ComponentLink2Description: https://datasheet.ciiva.com/15111/getdatasheetpartid-48347-15111093.pdf?src-supplier=Verical; ComponentLink3URL: https://datasheet.ciiva.com/2052/tlv1117-18-2052312.pdf?src-supplier=Digi-Key; ComponentLink3Description: https://datasheet.ciiva.com/2052/tlv1117-18-2052312.pdf?src-supplier=Digi-Key; ComponentLink4URL: https://datasheet.ciiva.com/2052/tlv1117-18-2052313.pdf?src-supplier=Digi-Key; ComponentLink4Description: https://datasheet.ciiva.com/2052/tlv1117-18-2052313.pdf?src-supplier=Digi-Key; ComponentLink5URL: https://datasheet.ciiva.com/2052/tlv1117-18-2052314.pdf?src-supplier=Digi-Key; ComponentLink5Description: https://datasheet.ciiva.com/2052/tlv1117-18-2052314.pdf?src-supplier=Digi-Key; ComponentLink6URL: https://datasheet.ciiva.com/46443/tlv1117-15-46443449.pdf?src-supplier=Element14; ComponentLink6Description: https://datasheet.ciiva.com/46443/tlv1117-15-46443449.pdf?src-supplier=Element14
V1 = Battery: SimulationGenericComponent: True
V2 = Battery: SimulationGenericComponent: True; DC Magnitude: 5